# EAGLE design battery-shield-biginductor (EAGLE 6.3)
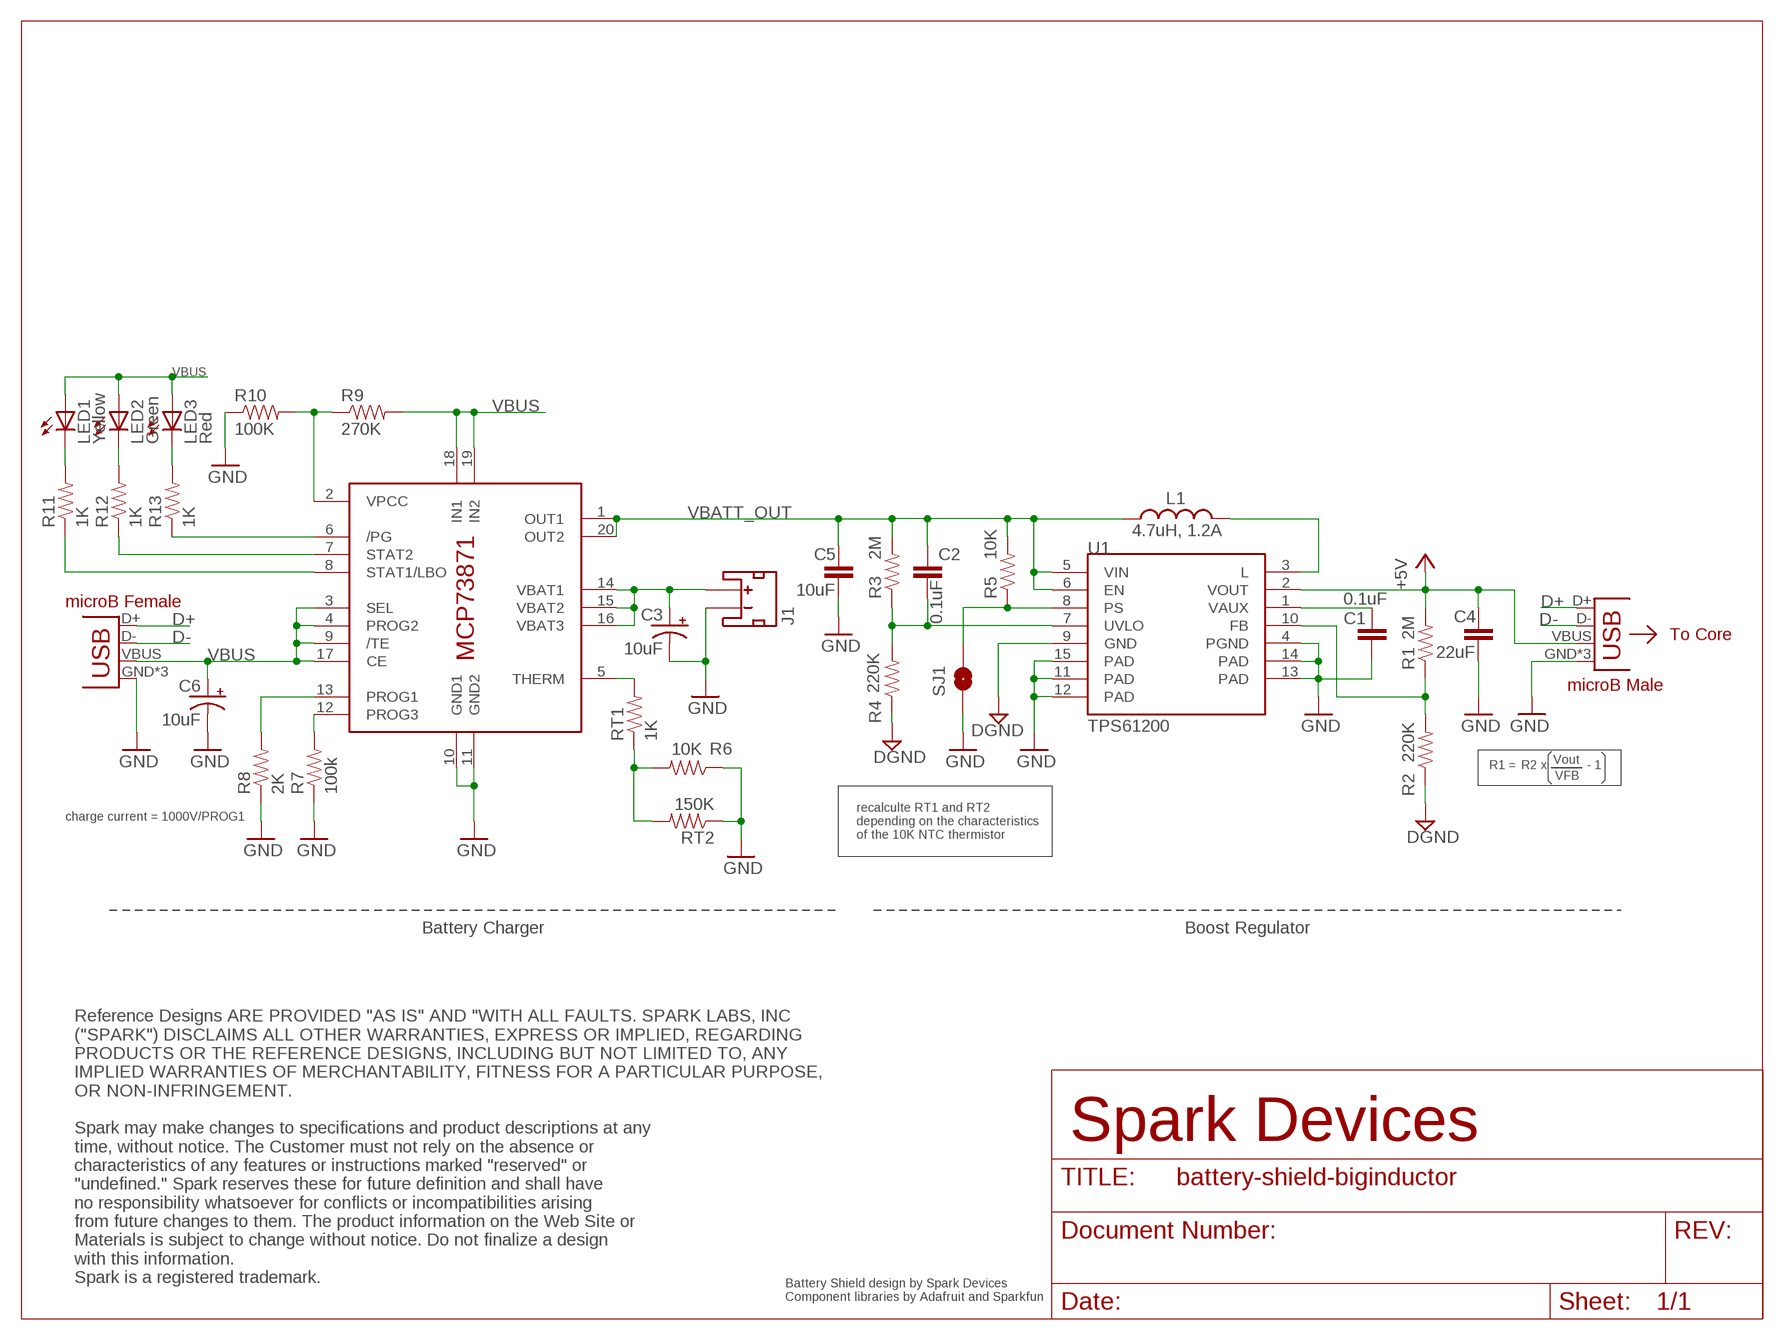
[diagram p0: schematic, sheet 1]

## Parts
C1  0.1uF  CAP0402-CAP  [0402-CAP]
C2  0.1uF  CAP0402-CAP  [0402-CAP]
C3  10uF  10UF-16V-10%(TANT)  [EIA3216]
C4  22uF  CAP0805  [0805]
C5  10uF  CAP1206  [1206]
C6  10uF  10UF-16V-10%(TANT)  [EIA3216]
IC1  MCP73871  [QFN20]
J1  JST_2MM_MALE  [JST-2-SMD]
JP1  USBUSB-MICROB-SLOT-HOLE  [USB-MICROB-SLOT-HOLE]
JP2  USBFCI  [USB-MICROB-MALE-SANDWICH]
L1  4.7uH, 1.2A  INDUCTOR-SPARKFUNVLS3012ET-4R7M  [INDUCTOR-VLS-E]
LED1  Yellow  LED0603  [LED-0603]
LED2  Green  LED0603  [LED-0603]
LED3  Red  LED0603  [LED-0603]
R1  2M  RESISTOR0402-RES  [0402-RES]
R2  220K  RESISTOR0402-RES  [0402-RES]
R3  2M  RESISTOR0402-RES  [0402-RES]
R4  220K  RESISTOR0402-RES  [0402-RES]
R5  10K  RESISTOR0402-RES  [0402-RES]
R6  10K  RESISTOR0402-RES  [0402-RES]
R7  100k  RESISTOR0402-RES  [0402-RES]
R8  2K  RESISTOR0402-RES  [0402-RES]
R9  270K  RESISTOR0402-RES  [0402-RES]
R10  100K  RESISTOR0402-RES  [0402-RES]
R11  1K  RESISTOR0402-RES  [0402-RES]
R12  1K  RESISTOR0402-RES  [0402-RES]
R13  1K  RESISTOR0402-RES  [0402-RES]
RT1  1K  RESISTOR0402-RES  [0402-RES]
RT2  150K  RESISTOR0402-RES  [0402-RES]
SJ1  SOLDERJUMPERNO  [SJ_2S-NO]
U1  TPS61200  [QFN-10_PAD]

## Nets
+5V: C4.1 JP2.VBUS R1.2 U1.2(VOUT)
D+: JP1.D+ JP2.D+
D-: JP1.D- JP2.D-
DGND: R2.1 R4.1 U1.9(GND)
GND: C1.2 C3.C(-) C4.2 C5.2 C6.C(-) IC1.10(GND1) IC1.11(GND2) J1.1(-) JP1.GND JP1.MT1(GND) JP1.MT2(GND) JP2.GND JP2.GNDPAD1(GND) JP2.GNDPAD2(GND) R6.1 R7.1 R8.1 R10.1 RT2.1 SJ1.1 U1.4(PGND) U1.11(PAD) U1.12(PAD) U1.13(PAD) U1.14(PAD) U1.15(PAD)
N$1: L1.P$2 U1.3(L)
N$2: C1.1 U1.1(VAUX)
N$3: C2.2 R3.1 R4.2 U1.7(UVLO)
N$4: R1.1 R2.2 U1.10(FB)
N$5: C3.A(+) IC1.14(VBAT1) IC1.15(VBAT2) IC1.16(VBAT3) J1.2(+)
N$6: IC1.8(STAT1/LBO) R11.1
N$7: R6.2 RT1.1 RT2.2
N$8: LED1.C R11.2
N$9: IC1.5(THERM) RT1.2
N$10: LED2.C R12.2
N$11: IC1.12(PROG3) R7.2
N$12: IC1.2(VPCC) R9.1 R10.2
N$13: IC1.13(PROG1) R8.2
N$14: IC1.7(STAT2) R12.1
N$15: IC1.6(/PG) R13.1
N$16: LED3.C R13.2
N$19: R5.1 SJ1.2 U1.8(PS)
VBATT_OUT: C2.1 C5.1 IC1.1(OUT1) IC1.20(OUT2) L1.P$1 R3.2 R5.2 U1.5(VIN) U1.6(EN)
VBUS: C6.A(+) IC1.3(SEL) IC1.4(PROG2) IC1.9(/TE) IC1.17(CE) IC1.18(IN1) IC1.19(IN2) JP1.VBUS LED1.A LED2.A LED3.A R9.2
Unconnected: J1.NC1(PAD1) J1.NC2(PAD2)

## Notes on the sheet
- microB Female
- To Core
- microB Male
- Vout
- R1 = | R2 | x | - 1
- VFB
- charge current = 1000V/PROG1
- recalculte RT1 and RT2
  depending on the characteristics
  of the 10K NTC thermistor
- Battery Charger | Boost Regulator
- Spark Devices
- Reference Designs ARE PROVIDED "AS IS" AND "WITH ALL FAULTS. SPARK LABS, INC 
  ("SPARK") DISCLAIMS ALL OTHER WARRANTIES, EXPRESS OR IMPLIED, REGARDING 
  PRODUCTS OR THE REFERENCE DESIGNS, INCLUDING BUT NOT LIMITED TO, ANY 
  IMPLIED WARRANTIES OF MERCHANTABILITY, FITNESS FOR A PARTICULAR PURPOSE,
  OR NON-INFRINGEMENT.
  
  Spark may make changes to specifications and product descriptions at any 
  time, without notice. The Customer must not rely on the absence or 
  characteristics of any features or instructions marked "reserved" or 
  "undefined." Spark reserves these for future definition and shall have 
  no responsibility whatsoever for conflicts or incompatibilities arising 
  from future changes to them. The product information on the Web Site or 
  Materials is subject to change without notice. Do not finalize a design 
  with this information. 
  Spark is a registered trademark.
- Battery Shield design by Spark Devices
  Component libraries by Adafruit and Sparkfun

## Library data of the parts
C1 C2 C4 = SparkFun-Passives:CAP: Capacitor Standard 0603 ceramic capacitor, and 0.1" leaded capacitor.
C3 C6 = SparkFun-Capacitors:10UF-16V-10%(TANT): CAP-00811 1206/EIA-3216 Tantalum capacitor; PROD_ID: CAP-00811
C5 = SparkFun-Capacitors:CAP: Capacitor Standard 0603 ceramic capacitor, and 0.1" leaded capacitor.
IC1 = adafruit:MCP73871
J1 = SparkFun-Connectors:JST_2MM_MALE: Mates to single-cell LiPo batteries. CONN-08352; PROD_ID: CONN-08352
JP1 JP2 = Spark:USB
L1 = Spark:INDUCTOR-SPARKFUN: Inductors Basic Inductor/Choke - 0603 and 1206. Footprints are not proven and vary greatly between part numbers. SRN6045- 33uH, 20% 1.4A
LED1-LED3 = SparkFun-LED:LED: LEDs Standard schematic elements and footprints for 5mm, 3mm, 1206, and 0603 sized LEDs. 5mm - Spark Fun Electronics SKU : COM-00529 (and others)
R1-R13 RT1 RT2 = SparkFun-Passives:RESISTOR: Resistor Basic schematic elements and footprints for 0603, 1206, and PTH resistors.
SJ1 = SparkFun-Passives:SOLDERJUMPER: Solder Jumper Standard SMD solder jumper. Used to automate production. Two varients : Normally Open and Normally Closed are the same, but have different paste layers. NC will have a large amount of paste and should jumper during reflow.
U1 = SparkFun-PowerIC:TPS61200: DC to DC Booster IC-10035; PROD_ID: IC-10035

## Board
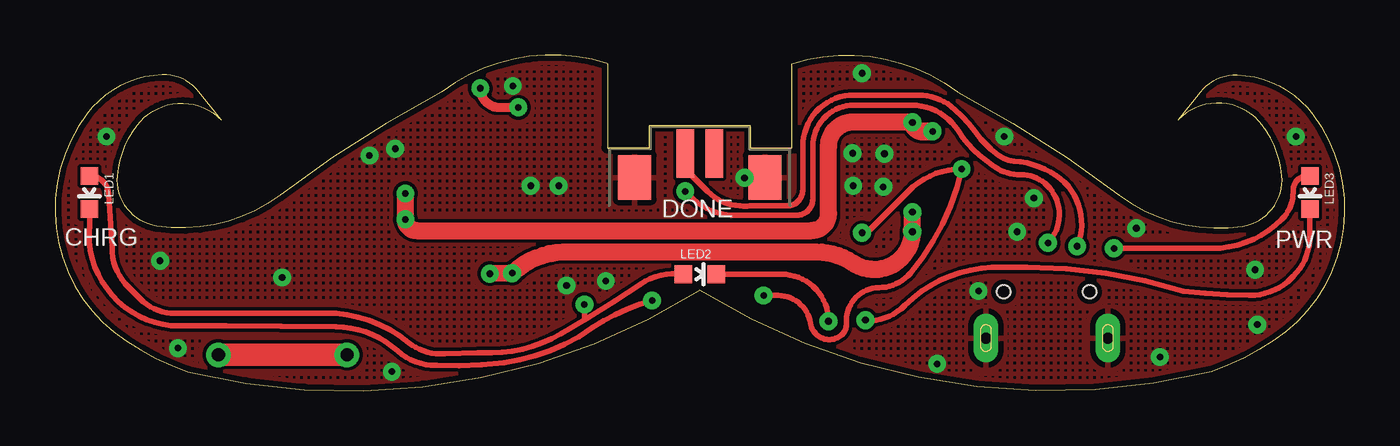
[diagram p1: board, top side]
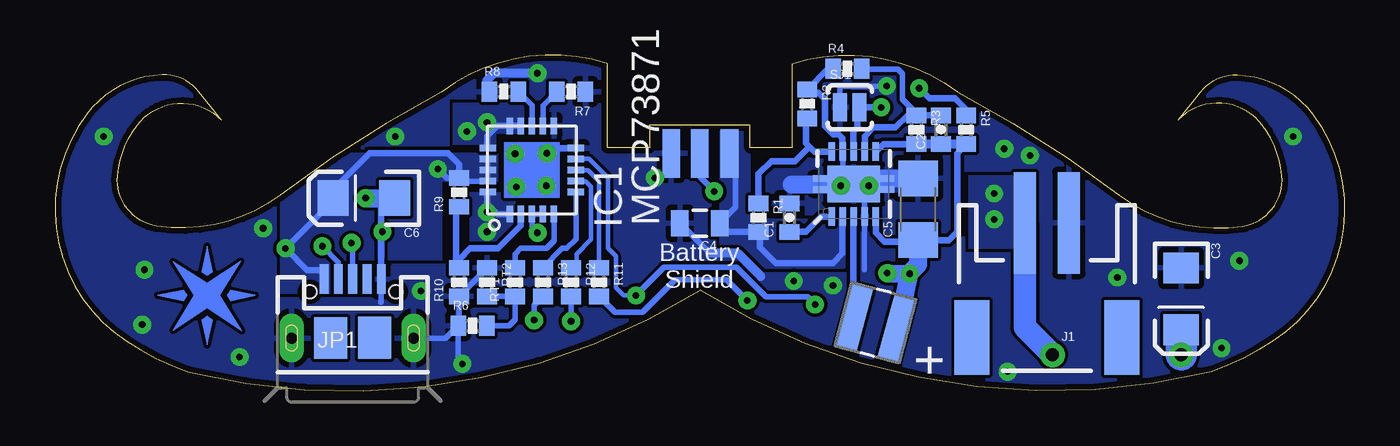
[diagram p2: board, bottom side, seen from below]

Size 58.5 x 15.22 mm. Coordinates in mm from the lower left corner, seen from the top.
Outline: 33.44,14.84 arc-55 40.93,13.57 arc-9 48.3,8.87 arc46 53.89,7.47 arc87 55.67,9.76 arc32 54.78,12.04 arc98 50.97,12.3 51.98,13.57 arc-53 53.63,14.33 arc-51 57.06,12.55 arc-94 55.29,2.26 arc-14 52.49,0.87 arc-46 29.25,4.55 arc-46 6.01,0.87 arc-14 3.22,2.26 arc-94 1.44,12.55 arc-51 4.87,14.33 arc-53 6.52,13.57 7.53,12.3 arc98 3.72,12.04 arc32 2.83,9.76 arc87 4.61,7.47 arc46 10.2,8.87 arc-9 17.57,13.57 arc-55 25.06,14.84 25.06,11.03 26.96,11.03 26.96,12.04 31.54,12.04 31.54,11.03 33.44,11.03 33.44,14.84
Copper layers (1*16): Top 0.035mm / dielectric 1.5mm / Bottom 0.035mm
Design rules "SparkFun *": minimum track width 8mil, minimum drill 0.3mm, track to track 6mil, track to pad 6mil, pad to pad 6mil, via to via 6mil, smd to smd 1mil, copper to edge 10mil, drill to drill 8mil, minimum pad ring 12mil, minimum via ring 10mil, stop-mask expansion 4mil, vias tented up to drill 25mil, thermal gap 10mil

### Footprints (pad centres in the part's own frame; a part is rotated, then mirrored left to right if it is on the bottom)
0402-CAP = smd 0.7 x 0.9: 1 -0.65,0; 2 0.65,0
EIA3216 = smd 1.4 x 1.6: A 1.4,0; C -1.4,0
0805 = smd 0.8 x 1.2: 1 -0.9,0; 2 0.9,0
1206 = smd 1.6 x 1.8: 1 -1.4,0; 2 1.4,0
QFN20 = smd 0.75 x 0.3: 1 -2,1; 2 -2,0.5; 3 -2,0; 4 -2,-0.5; 5 -2,-1; 11 2,-1; 12 2,-0.5; 13 2,0; 14 2,0.5; 15 2,1 | smd 0.3 x 0.75: 6 -1,-2; 7 -0.5,-2; 8 0,-2; 9 0.5,-2; 10 1,-2; 16 1,2; 17 0.5,2; 18 0,2; 19 -0.5,2; 20 -1,2
JST-2-SMD = smd 1 x 4.6: 1 -1,-3.7; 2 1,-3.7 | smd 1.6 x 3.4: NC1 -3.4,1.5; NC2 3.4,1.5
USB-MICROB-SLOT-HOLE = smd 0.4 x 1.35: D+ 0,2.675; D- -0.65,2.675; GND 1.3,2.675; ID 0.65,2.675; VBUS -1.3,2.675 | drill 0.5 pad 1.1 long: MT1 -2.775,0; MT2 2.775,0 | smd 1.5 x 1.9: P$1 -1,0; P$2 1,0.01 | hole 0.6: -1.95,2.1; 1.95,2.1
USB-MICROB-MALE-SANDWICH = smd 0.8 x 2.2 bottom: D+ 0,0; GND 1.3,0; VBUS -1.35,0 | smd 0.8 x 2.2: D- -0.65,0; ID 0.65,0 | smd 1.5 x 2: GNDPAD1 -2.95,-1.1; GNDPAD2 2.95,-1.1
INDUCTOR-VLS-E = smd 1 x 3: P$1 -1,0; P$2 1,0
LED-0603 = smd 0.8 x 0.8: A 0,-0.75; C 0,0.75
0402-RES = smd 0.7 x 0.9: 1 -0.65,0; 2 0.65,0
SJ_2S-NO = smd 0.635 x 1.27: 1 -0.45,0; 2 0.45,0
QFN-10_PAD = smd 0.297 x 0.85: 1 -1,-1.475; 2 -0.5,-1.475; 3 0,-1.475; 4 0.5,-1.475; 5 1,-1.475; 6 1,1.475; 7 0.5,1.475; 8 0,1.475; 9 -0.5,1.475; 10 -1,1.475 | smd 0.7 x 0.28: 11 -1.5,0.25; 12 -1.5,-0.25; 13 1.5,0.25; 14 1.5,-0.25 | smd 2.4 x 1.65: 15 0,0

### Placement (x,y rotation side)
C1  25.19,7.85 90 bottom
C2  18.3,11.84 90 bottom
C3  7.41,4.17 270 bottom
C4  29.25,7.6 180 bottom
C5  19.34,8.23 90 bottom
C6  44.49,8.74 180 bottom
IC1  36.87,10.01 90 bottom
J1  13.5,3.91 180 bottom
JP1  45,2.39 0 bottom
JP2  29.25,10.77 0 top
L1  21.28,3.09 165 bottom
LED1  1.56,8.99 180 top
LED2  29.25,5.29 270 top
LED3  56.94,8.99 180 top
R1  26.58,7.85 270 bottom
R2  24.37,13.01 270 bottom
R3  19.42,11.84 270 bottom
R4  22.55,14.61 0 bottom
R5  17.16,11.84 270 bottom
R6  39.56,2.95 0 bottom
R7  35.09,13.57 180 bottom
R8  38.14,13.57 0 bottom
R9  40.17,8.99 90 bottom
R10  40.17,4.93 90 bottom
R11  33.82,4.93 270 bottom
R12  35.09,4.93 270 bottom
R13  36.36,4.93 270 bottom
RT1  37.63,4.93 90 bottom
RT2  38.9,4.93 270 bottom
SJ1  22.44,12.86 0 bottom
U1  22.27,9.38 0 bottom
U$2  [SPARK_LOGO_PLUS_PLANE]  51.6,4.32 0 bottom

### Tracks (layer width: path | path; a pad name or v marks a point on that pad's centre or on a via)
+5V
  Bottom 0.254: 27.9,8.05 27.62,8.32 27.62,9.96 27.9,10.24
  Bottom 0.305: U1.2 22.77,6.23 23.21,5.79 25.8,5.79 26.51,6.51 26.51,7.13 R1.2 27.95,7.2 C4.1 27.9,8.05
  pour Bottom (no thermals): 22.7,7.72 22.7,5.59 28.29,5.59 28.29,11.84 27.02,11.84 27.02,7.72
D+  (via drill 0.3)
  Top 0.254: v28.59,9.05 28.79,8.84 arc48 30.93,7.95 33.67,7.95 arc90 34.38,8.74 34.38,11.08 arc-90 36.26,12.96 38.85,12.96 arc-57 40.99,11.79 arc25 42.53,10.24 arc44 43.8,9.81 arc-61 45.3,8.94 arc-75 v45.05,6.71
  Bottom 0.254: v28.59,9.05 29.25,9.71 29.25,10.26 | JP1.D+ 45,6.66 v45.05,6.71
  Bottom 0.406: JP2.D+ 29.25,10.26
D-  (via drill 0.3)
  Top 0.254: 28.6,10.1 28.6,10.05 29.61,9.05 arc42 31.08,8.38 arc7 31.54,8.38 33.21,8.38 arc90 33.92,9.1 33.92,11.08 arc-90 36.26,13.41 39.16,13.41 arc-43 40.83,12.75 arc-12 42,11.41 arc11 42.71,10.75 arc35 43.5,10.42 arc-30 45.43,9.76 arc-79 v46.37,6.56
  Top 0.406: JP2.D- 28.6,10.1
  Bottom 0.254: JP1.D- 45.65,5.83 v46.37,6.56
DGND
  Bottom 0.305: U1.9 22.77,11.45 22.95,11.64 23.21,11.64 23.56,11.99 23.56,13.21 23.87,13.52 24.23,13.52 R2.1 23.42,14.61 R4.1
GND  (via drill 0.3, 0.3 pad 0.61)
  Bottom 0.254: RT2.1 38.9,5.55 R10.1 40.17,2.99 R6.1 | U1.4 21.78,7.92 21.78,8.74 | U1.14 21.4,9.13 arc-90 21.78,8.74 | 21.78,8.74 21.78,8.89 arc-90 U1.15 | JP1.GND 43.7,4.05 arc90 43.73,4.02 | SJ1.1 22.89,13.82 v20.77,13.82 | R6.1 40.77,2.39 JP1.MT2 | v40.02,1.22 40.21,1.41 R6.1 | C4.2 28.8,6.25 | U1.4 21.76,7.89 | 21.78,5.49 21.78,7.78 U1.4
  Bottom 0.305: IC1.10 36.26,11.01 v37.63,10.75 | JP1.GND 43.7,7.17 | 43.7,7.17 v43.65,7.22 | 43.7,7.17 43.7,8.46 43.73,8.49
  Bottom 0.406: v36.62,14.4 38.57,14.4 38.9,14.07 38.9,13.68 R8.1 | 28.8,6.25 27.55,6.25 26.48,5.18
  Bottom 0.813: v44.41,8.74 C6.C | C5.2 22.01,9.63 U1.15 22.29,9.35 25.08,9.35
  other vias: 36.18,10.77 56.3,11.53 2.33,11.53 49.06,7.37 54.45,5.49 5.58,1.93 50.13,1.53 54.55,3 4.77,5.9 10.3,5.13 15.43,10.98 21.58,9.3 22.85,9.3 14.26,10.67 41.9,4.52 31.28,9.66 43.07,11.53 36.21,9.3 37.58,9.25 15.28,0.87 23.21,4.78 24.98,4.98
  pour Bottom (rank 3): -1.48,-1.17 -1.48,16.61 59.48,16.61 59.48,-1.17
  pour Top (rank 3, hatched): -1.48,-1.17 -1.48,16.61 59.48,16.61 59.48,-1.17
N$1
  Bottom 0.305: U1.3 22.27,3.37 L1.P$2
N$2
  Bottom 0.305: U1.1 23.74,7.9 24.42,7.22 25.17,7.22 C1.1
N$3
  Bottom 0.254: 19.42,12.58 20.06,13.21 20.06,14.38 20.26,14.58 21.87,14.58 R4.2
  Bottom 0.305: R3.1 C2.2 | R3.1 19.81,12.49 20.36,11.94 21.38,11.94 21.77,11.55 U1.7 | R3.1 19.42,12.58 | 21.77,14.48 R4.2
N$4
  Bottom 0.305: U1.10 24.05,10.85 24.27,11.08 | 24.27,11.08 24.42,11.23 24.42,12.31 R2.2 | R1.1 26.58,9.83 26,10.42 24.93,10.42 24.27,11.08
N$5  (via drill 0.3, 0.3 pad 0.61, 0.6)
  Top 0.762: v15.89,8.94 v15.89,7.78 arc90 16.4,7.27 34.33,7.27 arc90 35.09,8.03 35.09,11.08 arc-90 36.21,12.19 38.88,12.19 arc-90 v38.9,12.17 | 39.31,11.76 arc-90 v38.9,12.17 | v38.9,12.17 38.85,12.09
  Top 0.813: 39.31,11.76 v39.82,11.76
  Top 1.016: v13.25,1.63 v7.41,1.63
  Bottom 0.305: IC1.14 IC1.15 38.43,12.01 | 38.43,12.01 38.9,11.53 38.9,11.04 IC1.16 | 38.43,12.01 38.74,12.01 v38.9,12.17
  Bottom 1.016: J1.2 14.5,2.88 v13.25,1.63
  Bottom 1.422: C3.A v7.41,1.63
  pour Bottom (no thermals): 37.25,11.66 38.52,11.66 38.52,11.15 40.43,11.15 40.43,13.06 37.25,13.06
  pour Bottom (no thermals): 14.14,9.76 17.06,9.76 17.06,6.45 14.14,6.45
N$6
  Bottom 0.203: IC1.8 34.33,10.01 33.82,9.5 R11.1
N$7
  Bottom 0.254: RT2.2 RT1.1 37.63,3.22 37.9,2.95 R6.2
N$8  (via drill 0.3 pad 0.61)
  Top 0.254: LED1.C 1.56,7.52 arc90 5.27,2.95 arc-1 12.74,2.9 arc-43 15.53,1.81 arc41 17.31,1.15 arc10 20.36,1.27 arc27 24.37,2.85 arc-19 v27.09,4.09
  Bottom 0.254: R11.2 33.1,3.56 31.84,3.56 30.37,5.03 28.03,5.03 v27.09,4.09
N$9
  Bottom 0.254: 35.85,7.99 IC1.5 35.87,6.79 36.21,6.45 37.38,6.45 37.63,6.2 RT1.2
N$10  (via drill 0.3)
  Top 0.254: LED2.C 32.96,5.29 arc-90 v35.09,3.15
  Bottom 0.254: R12.2 v35.09,3.15
N$11
  Bottom 0.254: IC1.12 36.37,12.94 R7.2
N$12
  Bottom 0.254: R9.1 40.31,8.34
  Bottom 0.305: 40.31,8.34 40.31,5.72 R10.2 40.17,5.95 39.66,6.45 38.39,6.45 37.37,7.48 IC1.2
N$13
  Bottom 0.254: IC1.13 36.87,12.95 R8.2
N$14
  Bottom 0.203: 34.86,9.5 34.43,9.5 34.18,9.25 34.18,6.86 34.84,6.2 34.84,5.83 R12.1
  Bottom 0.254: 34.86,9.5 IC1.7
N$15
  Bottom 0.254: IC1.6 34.87,6.88 35.3,6.45 35.49,6.45 R13.1
N$16  (via drill 0.3)
  Top 0.254: v36.77,3.2 36.82,3.15 arc45 38.55,3.87 arc-43 42.51,5.59 arc-4 44.08,5.59 arc-17 51.2,4.52 arc8 54.19,4.32 arc45 56.1,5.11 56.17,5.18 arc45 56.94,7.02 LED3.C
  Bottom 0.254: R13.2 36.77,3.87 v36.77,3.2
N$17  (via drill 0.3 pad 0.61)
  other vias: 19.73,5.31
N$18
  Bottom 0.254: 22.75,10.77 22.75,9.76
N$19  (via drill 0.3)
  Top 0.406: v19.29,13.72 arc90 20.16,12.86 v21.02,12.86
  Bottom 0.305: U1.8 22.27,11.76 22.09,11.94 22.09,12.76 SJ1.2 v21.02,12.86 | R5.1 17.16,12.75 17.67,13.26 18.84,13.26 v19.29,13.72
VBATT_OUT  (via drill 0.3 pad 0.61)
  Top 0.762: v38.9,7.22 v38.9,8.11 | 19.73,5.31 v20.74,5.34 arc-45 23.39,6.3 34.53,6.3 arc-34 36.21,5.79 arc123 v38.9,7.22 | 38.85,7.27 v38.9,7.22
  Bottom 0.254: IC1.1 38.36,8.01 38.39,7.98 | 20.11,3.66 L1.P$1
  Bottom 0.305: IC1.1 38.43,8.01 38.9,8.49 38.9,8.98 IC1.20 | R3.2 20.93,11.19 U1.6 | R5.2 17.57,10.78 17.57,7.22 17.95,6.83 C5.1 19.42,6.76 20.87,6.76 21.27,7.16 U1.5
  Bottom 0.406: R5.2 C2.1 R3.2
  Bottom 0.813: v20.74,5.34 19.75,5.31 | C5.1 19.34,5.72 19.75,5.31 | 19.75,5.31 20.11,3.66
  pour Bottom (no thermals): 37.63,8.49 37.63,6.71 39.66,6.71 39.66,8.99 37.63,8.99
VBUS  (via drill 0.3, 0.3 pad 0.61)
  Top 0.254: 28.35,5.44 LED2.A arc42 26.56,4.83 arc-5 22.95,2.59 | LED1.A arc-90 2.43,8.88 2.58,6.51 arc45 3.33,4.68 3.85,4.17 arc45 5.44,3.51 12.74,3.51 arc-35 16.04,2.19 arc44 17.67,1.68 19.19,1.72 19.8,1.73 arc31 22.95,2.59 | v32.15,4.32 32.81,4.32 arc-82 34.28,3.05 arc124 35.7,2.54 arc52 35.91,3.05 arc-93 37.38,4.68 arc50 38.8,5.34 arc28 v41.14,10.06 arc45 38.71,9.06 36.96,7.31 arc-45 v36.62,7.17 | v48.05,6.45 52.48,6.45 arc45 55.67,7.78 arc45 56.17,9 56.17,9.1 arc-90 56.82,9.74 LED3.A | v24.02,3.91 24.02,3.3 24.07,3.25 22.95,2.59
  Bottom 0.203: v32.15,4.32 32.7,4.32 33.06,4.68 33.06,6.1 33.42,6.45 33.42,9.65 34.28,10.52 IC1.9
  Bottom 0.254: IC1.17 IC1.18 IC1.19 40.04,9.51 R9.2 40.72,9.64 v41.14,10.06 | IC1.4 IC1.3 36.87,7.47 36.62,7.22 v36.62,7.17 | 32.25,4.32 v32.15,4.32 30.88,5.59 27.57,5.59 26.25,4.27 24.37,4.27 v24.02,3.91
  Bottom 0.305: JP1.VBUS 46.3,5.47 47.06,5.47 v48.05,6.45 45.89,8.61 C6.A 45.51,8.74 45.51,9.5 44.24,10.77 40.68,10.77 40.17,10.26 R9.2
  pour Bottom (rank 2, no thermals): 38.39,10.77 48.3,10.77 48.3,4.42 46.01,4.42 46.01,5.95 40.93,5.95 40.93,9.5 38.39,9.5

### Text on the board
tPlace: DONE | CHRG | PWR
bPlace: Battery / Shield | +